# Altium schematic sheet FX2 USB Microcontroller.SchDoc: Cypress Molson - FX2 USB Microcontroller
size B; CompanyName: Linear Systems Ltd.; DrawnBy: G. Cosens; Engineer: G. Cosens; Organization: Linear Systems Ltd.; Address1: 1717 Dublin Avenue, Unit 1; Address2: Winnipeg, MB, Canada; Address3: R3H 0H2; DocumentNumber: LS7652; Revision: 1; SheetNumber: 02; SheetTotal: 12
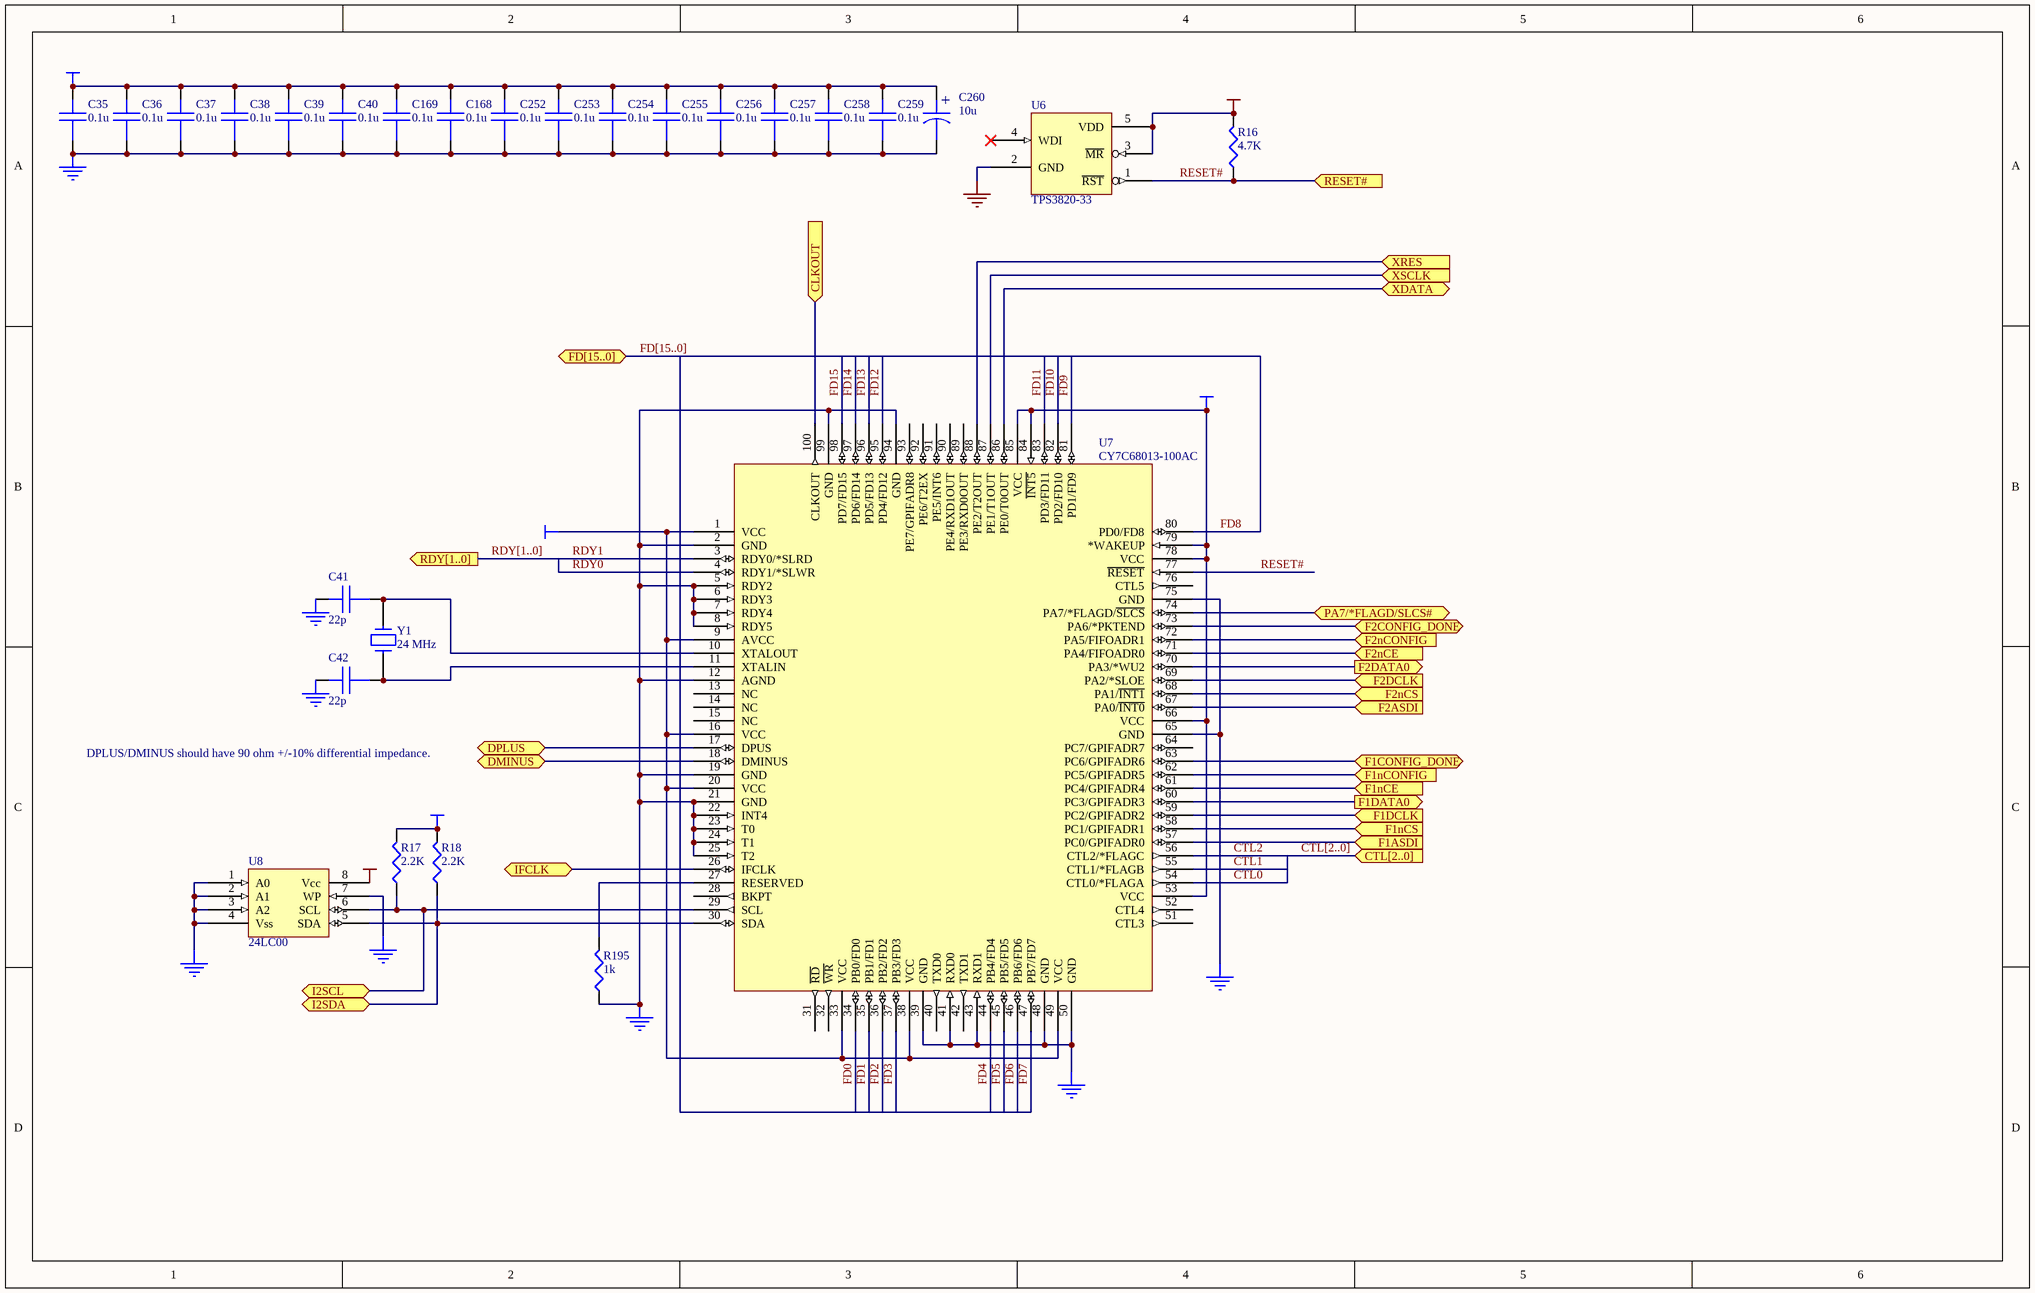
[diagram p0: FX2 USB Microcontroller.SchDoc]

## Parts
C35  (no value)  [0603]
C36  (no value)  [0603]
C37  (no value)  [0603]
C38  (no value)  [0603]
C39  (no value)  [0603]
C40  (no value)  [0603]
C41  (no value)  [0603]
C42  (no value)  [0603]
C168  (no value)  [0603]
C169  (no value)  [0603]
C252  (no value)  [0603]
C253  (no value)  [0603]
C254  (no value)  [0603]
C255  (no value)  [0603]
C256  (no value)  [0603]
C257  (no value)  [0603]
C258  (no value)  [0603]
C259  (no value)  [0603]
C260  10u  [6032]
R16  4.7K  [0603]
R17  2.2K  [0603]
R18  2.2K  [0603]
R195  1k  [0603]
U6  TPS3820-33  [DBV]
U7  (no value)  [R-QFP14x20-G100/P.65N]
U8  24LC00  [SO-8]
Y1  24 MHz  [HC-49]

## Ports
CLKOUT (in), CTL[2..0] (in), DMINUS (bidir), DPLUS (bidir), F1ASDI (in), F1CONFIG_DONE (bidir), F1DATA0 (out), F1DCLK (in), F1nCE (in), F1nCONFIG (in), F1nCS (in), F2ASDI (in), F2CONFIG_DONE (bidir), F2DATA0 (out), F2DCLK (in), F2nCE (in), F2nCONFIG (in), F2nCS (in), FD[15..0] (bidir), I2SCL (bidir), I2SDA (bidir), IFCLK (bidir), PA7/*FLAGD/SLCS# (bidir), RDY[1..0] (out), RESET# (in), XDATA (bidir), XRES (in), XSCLK (in)

## Nets
+3.3V: C35.1 C36.1 C37.1 C38.1 C39.1 C40.1 C168.1 C169.1 C252.1 C253.1 C254.1 C255.1 C256.1 C257.1 C258.1 C259.1 C260.1 R16.2 R17.2 R18.2 U6.3(~{MR}) U6.5(VDD) U7.1(VCC) U7.9(AVCC) U7.16(VCC) U7.20(VCC) U7.33(VCC) U7.38(VCC) U7.49(VCC) U7.53(VCC) U7.66(VCC) U7.78(VCC) U7.79(*WAKEUP) U7.84(~{INT5}) U7.85(VCC) U8.8(Vcc)
GND: C35.2 C36.2 C37.2 C38.2 C39.2 C40.2 C41.1 C42.1 C168.2 C169.2 C252.2 C253.2 C254.2 C255.2 C256.2 C257.2 C258.2 C259.2 C260.2 R195.1 U6.2(GND) U7.2(GND) U7.5(RDY2) U7.6(RDY3) U7.7(RDY4) U7.8(RDY5) U7.12(AGND) U7.19(GND) U7.21(GND) U7.22(INT4) U7.23(T0) U7.24(T1) U7.25(T2) U7.39(GND) U7.41(RXD0) U7.43(RXD1) U7.48(GND) U7.50(GND) U7.65(GND) U7.75(GND) U7.94(GND) U7.99(GND) U8.1(A0) U8.2(A1) U8.3(A2) U8.4(Vss) U8.7(WP)
CLKOUT: U7.100(CLKOUT) ; port CLKOUT
CTL0: U7.54(CTL0/*FLAGA)
CTL1: U7.55(CTL1/*FLAGB)
CTL2: U7.56(CTL2/*FLAGC)
DMINUS: U7.18(DMINUS) ; port DMINUS
DPLUS: U7.17(DPUS) ; port DPLUS
F1ASDI: U7.57(PC0/GPIFADR0) ; port F1ASDI
F1CONFIG_DONE: U7.63(PC6/GPIFADR6) ; port F1CONFIG_DONE
F1DATA0: U7.60(PC3/GPIFADR3) ; port F1DATA0
F1DCLK: U7.59(PC2/GPIFADR2) ; port F1DCLK
F1nCE: U7.61(PC4/GPIFADR4) ; port F1nCE
F1nCONFIG: U7.62(PC5/GPIFADR5) ; port F1nCONFIG
F1nCS: U7.58(PC1/GPIFADR1) ; port F1nCS
F2ASDI: U7.67(PA0/~{INT0}) ; port F2ASDI
F2CONFIG_DONE: U7.73(PA6/*PKTEND) ; port F2CONFIG_DONE
F2DATA0: U7.70(PA3/*WU2) ; port F2DATA0
F2DCLK: U7.69(PA2/*SLOE) ; port F2DCLK
F2nCE: U7.71(PA4/FIFOADR0) ; port F2nCE
F2nCONFIG: U7.72(PA5/FIFOADR1) ; port F2nCONFIG
F2nCS: U7.68(PA1/~{INT1}) ; port F2nCS
FD0: U7.34(PB0/FD0)
FD1: U7.35(PB1/FD1)
FD2: U7.36(PB2/FD2)
FD3: U7.37(PB3/FD3)
FD4: U7.44(PB4/FD4)
FD5: U7.45(PB5/FD5)
FD6: U7.46(PB6/FD6)
FD7: U7.47(PB7/FD7)
FD8: U7.80(PD0/FD8)
FD9: U7.81(PD1/FD9)
FD10: U7.82(PD2/FD10)
FD11: U7.83(PD3/FD11)
FD12: U7.95(PD4/FD12)
FD13: U7.96(PD5/FD13)
FD14: U7.97(PD6/FD14)
FD15: U7.98(PD7/FD15)
I2SCL: R17.1 U7.29(SCL) U8.6(SCL) ; port I2SCL
I2SDA: R18.1 U7.30(SDA) U8.5(SDA) ; port I2SDA
IFCLK: U7.26(IFCLK) ; port IFCLK
PA7/*FLAGD/SLCS#: U7.74(PA7/*FLAGD/~{SLCS}) ; port PA7/*FLAGD/SLCS#
RDY0: U7.4(RDY1/*SLWR)
RDY1: U7.3(RDY0/*SLRD)
RESET#: R16.1 U6.1(~{RST}) U7.77(~{RESET}) ; port RESET#
XDATA: U7.86(PE0/T0OUT) ; port XDATA
XRES: U7.88(PE2/T2OUT) ; port XRES
XSCLK: U7.87(PE1/T1OUT) ; port XSCLK
NetC41_2: C41.2 U7.10(XTALOUT) Y1.2
NetC42_2: C42.2 U7.11(XTALIN) Y1.1
NetR195_2: R195.2 U7.27(RESERVED)

Not connected (* = marked no-connect by the designer): U6 4(WDI)*; U7 13(NC) 14(NC) 15(NC) 28(BKPT) 31(~{RD}) 32(~{WR}) 40(TXD0) 42(TXD1) 51(CTL3) 52(CTL4) 64(PC7/GPIFADR7) 76(CTL5) 89(PE3/RXD0OUT) 90(PE4/RXD1OUT) 91(PE5/INT6) 92(PE6/T2EX) 93(PE7/GPIFADR8)

## Buses and harness runs
bus CTL[2..0] = port CTL[2..0]
bus FD[15..0] = port FD[15..0]
bus RDY[1..0] = port RDY[1..0]

## Notes on the sheet
- DPLUS/DMINUS should have 90 ohm +/-10% differential impedance.
- Size
- Date:
- B
- Drawing Number
- Sheet
- Revision
- of
- File:
- Drawn By:
- G. Cosens
- (in symbol CAPACITOR POL) +

## Library data of the parts
C35-C42 C168 C169 C252-C259 = CAP: SMT CAP
C260 = CAPACITOR POL: Text Field1: 20; Text Field2: 20
R16-R18 R195 = RES1
U6 = TPS3820: Processor Supervisory Circuit; Text Field1: 60; Text Field2: 60
U7 = CY7C68013-100AC
U8 = 24LC00: 128-bit I2C Bus Serial EEPROM; Text Field1: 60; Text Field2: 50
Y1 = CRYSTAL